# Altium project LVPowerModule.PrjPcb
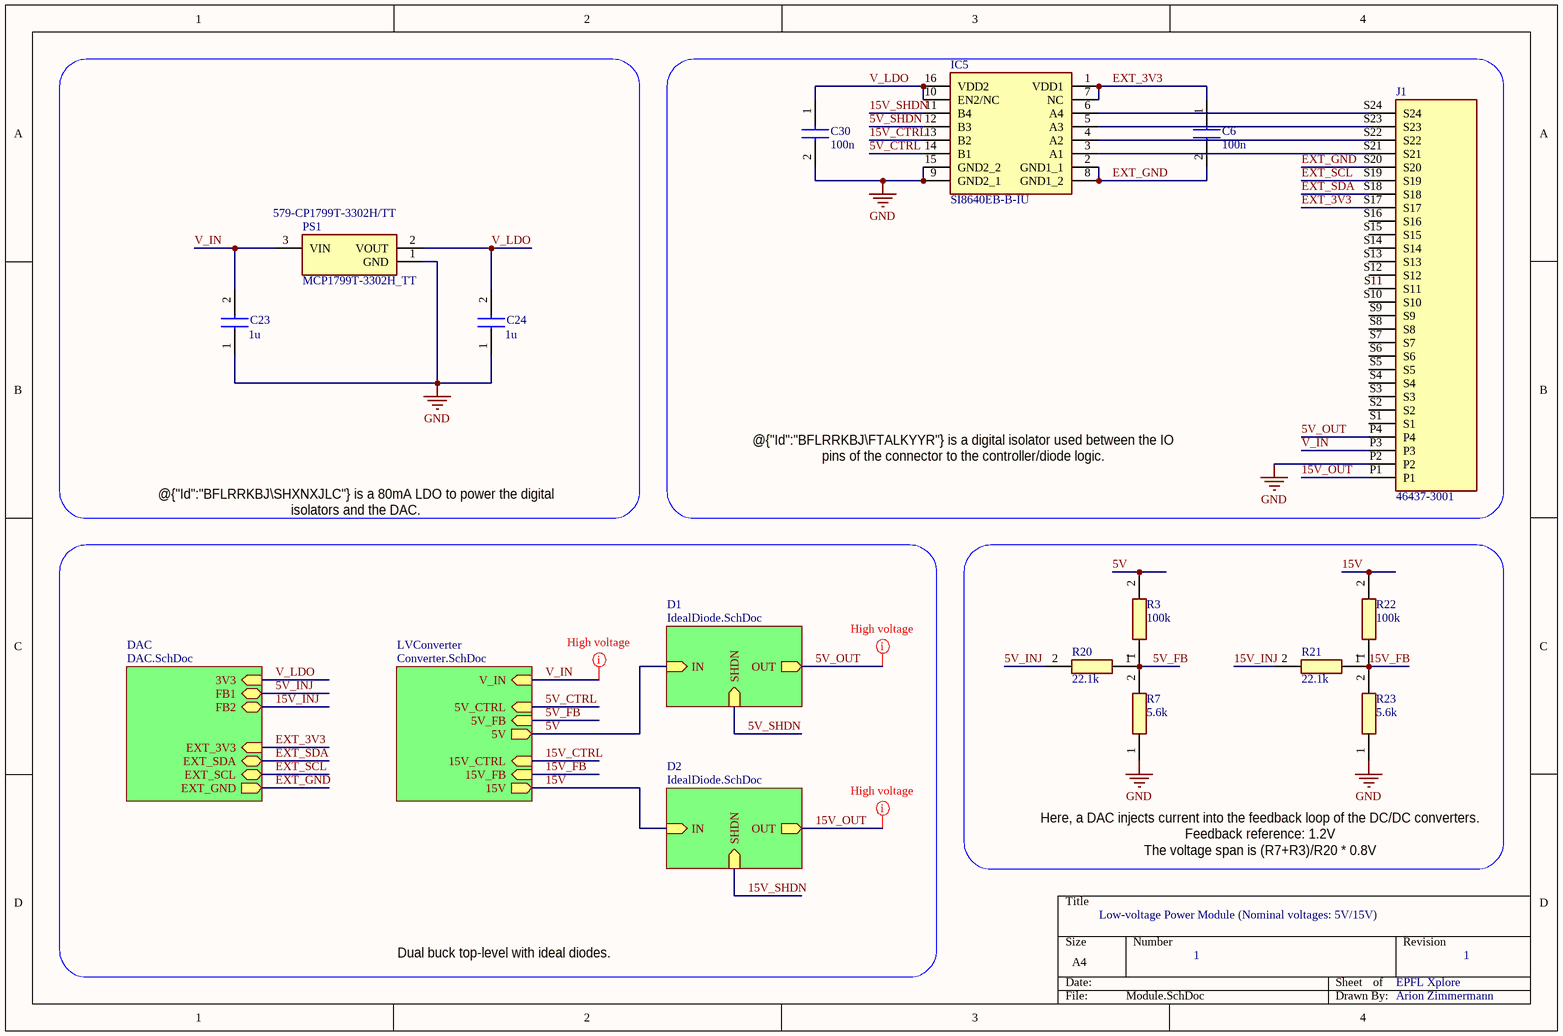
[diagram p0: Module.SchDoc]
4 sheets, 81 parts. Net scope: hierarchical (ports join the sheet entries above them; power ports are global).
Board file: LVPowerModule.PcbDoc
Sheets:
  Module.SchDoc
    LVConverter = Converter.SchDoc
    DAC = DAC.SchDoc
    D2 = IdealDiode.SchDoc
    D1 = IdealDiode.SchDoc

## Sheet Module.SchDoc
size A4; SheetNumber: 1; SheetTotal: 4

### Parts
C6  value 100n  [CAPC1608X95N]  (hidden comment: C0603C104K5RACTU)
C23  value 1u  [CAPC3216X110N]  (hidden comment: C1206C105K5RAC)
C24  value 1u  [CAPC3216X110N]  (hidden comment: C1206C105K5RAC)
C30  value 100n  [CAPC1608X95N]  (hidden comment: C0603C104K5RACTU)
IC5  SI8640EB-B-IU  [SOP64P600X175-16N]
J1  46437-3001  [464373001]
PS1  MCP1799T-3302H_TT  Supplier Part Number 1: 579-CP1799T-3302H/TT  [SOT95P237X112-3N]
R3  value 100k  [RESC1608X55N]  (hidden comment: CRCW0603100KJNEAC)
R7  value 5.6k  [RESC1608X50N]  (hidden comment: CRCW06035K60JNEAC)
R20  value 22.1k  [RESC1608X50N]  (hidden comment: CRCW060322K1FKEB)
R21  value 22.1k  [RESC1608X50N]  (hidden comment: CRCW060322K1FKEB)
R22  value 100k  [RESC1608X55N]  (hidden comment: CRCW0603100KJNEAC)
R23  value 5.6k  [RESC1608X50N]  (hidden comment: CRCW06035K60JNEAC)

### Sub-sheets
D1 = IdealDiode.SchDoc: IN (in), OUT (out), SHDN (in)
D2 = IdealDiode.SchDoc: IN (in), OUT (out), SHDN (in)
DAC = DAC.SchDoc: 3V3 (in), FB2 (bidir), FB1 (bidir), EXT_3V3 (in), EXT_SDA (bidir), EXT_SCL (bidir), EXT_GND (out)
LVConverter = Converter.SchDoc: V_IN (in), 5V (out), 15V (out), 5V_CTRL (in), 15V_CTRL (in), 5V_FB (in), 15V_FB (in)

### Nets
GND: C23.1 C24.1 C30.2 IC5.9(GND2_1) IC5.15(GND2_2) J1.P2 PS1.1(GND) R7.1 R23.1
5V: R3.2 ; sheet LVConverter/5V, sheet D1/IN
5V_CTRL: IC5.14(B1) ; sheet LVConverter/5V_CTRL
5V_FB: R3.1 R7.2 R20.1 ; sheet LVConverter/5V_FB
5V_INJ: R20.2 ; sheet DAC/FB1
5V_OUT: J1.P4 ; sheet D1/OUT
5V_SHDN: IC5.12(B3) ; sheet D1/SHDN
15V: R22.2 ; sheet LVConverter/15V, sheet D2/IN
15V_CTRL: IC5.13(B2) ; sheet LVConverter/15V_CTRL
15V_FB: R21.1 R22.1 R23.2 ; sheet LVConverter/15V_FB
15V_INJ: R21.2 ; sheet DAC/FB2
15V_OUT: J1.P1 ; sheet D2/OUT
15V_SHDN: IC5.11(B4) ; sheet D2/SHDN
EXT_3V3: C6.1 IC5.1(VDD1) IC5.7(NC) J1.S17 ; sheet DAC/EXT_3V3
EXT_GND: C6.2 IC5.2(GND1_1) IC5.8(GND1_2) J1.S20 ; sheet DAC/EXT_GND
EXT_SCL: J1.S19 ; sheet DAC/EXT_SCL
EXT_SDA: J1.S18 ; sheet DAC/EXT_SDA
V_IN: C23.2 J1.P3 PS1.3(VIN) ; sheet LVConverter/V_IN
V_LDO: C24.2 C30.1 IC5.10(EN2/NC) IC5.16(VDD2) PS1.2(VOUT) ; sheet DAC/3V3
NetIC5_3: IC5.3(A1) J1.S21
NetIC5_4: IC5.4(A2) J1.S22
NetIC5_5: IC5.5(A3) J1.S23
NetIC5_6: IC5.6(A4) J1.S24

Not connected (* = marked no-connect by the designer): J1 S1 S2 S3 S4 S5 S6 S7 S8 S9 S10 S11 S12 S13 S14 S15 S16

### Layout directives
net class HV4: 15V_OUT
net class HV2: 5V_OUT
net class HV: V_IN

### Notes on the sheet
- @{"Id":"BFLRRKBJ\SHXNXJLC"} is a 80mA LDO to power the digital isolators and the DAC.
- @{"Id":"BFLRRKBJ\FTALKYYR"} is a digital isolator used between the IO pins of the connector to the controller/diode logic.
- Here, a DAC injects current into the feedback loop of the DC/DC converters.
  Feedback reference: 1.2V
  The voltage span is (R7+R3)/R20 * 0.8V
- Low-voltage Power Module (Nominal voltages: 5V/15V)
- Dual buck top-level with ideal diodes.
- 1
- EPFL Xplore
- Arion Zimmermann

### Library data of the parts
C6 C30 = C0603C104K5RACTU: Capacitor; Manufacturer_Name: Kemet; Datasheet Link: http://www.farnell.com/datasheets/2205446.pdf; Height: 0.95mm; Manufacturer_Part_Number: C0603C104K5RACTU; Mouser Part Number: 80-C0603C104K5R; Mouser Price/Stock: https://www.mouser.co.uk/ProductDetail/KEMET/C0603C104K5RACTU?qs=l5k%252BbMnNDkkVcnZPSAaaiQ%3D%3D; Arrow Part Number: C0603C104K5RACTU; Arrow Price/Stock: https://www.arrow.com/en/products/c0603c104k5ractu/kemet-corporation; Supplier 1: Mouser; Supplier Part Number 1: 80-C0603C104K5R
C23 C24 = C1206C105K5RAC: Capacitor; Manufacturer_Name: KEMET; Datasheet Link: https://www.kemet.com/specsheet/C1206C105K5RACTU; Height: 1.1mm; Manufacturer_Part_Number: C1206C105K5RAC; Mouser Part Number: 80-C1206C105K5RAC; Mouser Price/Stock: https://www.mouser.co.uk/ProductDetail/KEMET/C1206C105K5RAC?qs=NTAB53G5bVDYFBtoIe7UwQ%3D%3D; Arrow Part Number: C1206C105K5RAC; Arrow Price/Stock: https://www.arrow.com/en/products/c1206c105k5rac/kemet-corporation
IC5 = SI8640EB-B-IU: Integrated Circuit; Manufacturer_Name: Skyworks; Datasheet Link: https://www.mouser.in/datasheet/2/472/si864x_datasheet-2507790.pdf; Height: 1.75mm; Manufacturer_Part_Number: SI8640EB-B-IU; Mouser Part Number: 634-SI8640EB-B-IU; Mouser Price/Stock: https://www.mouser.co.uk/ProductDetail/Skyworks-Solutions-Inc/SI8640EB-B-IU?qs=1mbolxNpo8djAX8%252BwHCeQQ%3D%3D
J1 = 46437-3001: Connector; Manufacturer_Name: Molex; Datasheet Link: https://componentsearchengine.com/Datasheets/1/46437-3007.pdf; Height: 10mm; Manufacturer_Part_Number: 46437-3001; Mouser Part Number: 538-46437-3001; Mouser Price/Stock: https://www.mouser.com/Search/Refine.aspx?Keyword=538-46437-3007; System: Connector
PS1 = MCP1799T-3302H_TT: Power Supply; Manufacturer_Name: Microchip; Manufacturer_Part_Number: MCP1799T-3302H/TT; Datasheet Link: https://ms.componentsearchengine.com/Datasheets/1/MCP1799T-3302H_TT.pdf; Height: 1.12mm; Mouser Part Number: 579-CP1799T-3302H/TT; Mouser Price/Stock: https://www.mouser.co.uk/ProductDetail/Microchip-Technology-Atmel/MCP1799T-3302H-TT?qs=BJlw7L4Cy78EAGTR6Iuibw%3D%3D; Arrow Part Number: MCP1799T-3302H/TT; Arrow Price/Stock: https://www.arrow.com/en/products/mcp1799t-3302htt/microchip-technology?region=nac; Supplier 1: Mouser
R3 R22 = CRCW0603100KFKEAC: Resistor; Manufacturer_Name: Vishay; Datasheet Link: https://www.mouser.com/datasheet/2/427/crcwce3-1223726.pdf; Height: 0.55mm; Manufacturer_Part_Number: CRCW0603100KFKEAC; Mouser Part Number: 71-CRCW0603100KFKEAC; Mouser Price/Stock: https://www.mouser.co.uk/ProductDetail/Vishay-Dale/CRCW0603100KFKEAC?qs=E3Y5ESvWgWPxzfNYyMgX1w%3D%3D; Arrow Part Number: CRCW0603100KFKEAC; Arrow Price/Stock: https://www.arrow.com/en/products/crcw0603100kfkeac/vishay; Supplier 1: Mouser; Supplier Part Number 1: 71-CRCW0603100KJNEAC
R7 R23 = CRCW06035K62FKEB: Resistor; Manufacturer_Name: Vishay; Datasheet Link: http://www.vishay.com/docs/20035/dcrcwe3.pdf; Height: 0.5mm; Manufacturer_Part_Number: CRCW06035K62FKEB; Mouser Part Number: 71-CRCW06035K62FKEB; Mouser Price/Stock: https://www.mouser.co.uk/ProductDetail/Vishay-Dale/CRCW06035K62FKEB?qs=P6ImCWcZKGBvDktlVJxa7w%3D%3D; Supplier 1: Mouser; Supplier Part Number 1: 71-CRCW06035K60JNEAC
R20 R21 = CRCW06037K50FKEB: Resistor; Manufacturer_Name: Vishay; Datasheet Link: http://www.vishay.com/docs/20035/dcrcwe3.pdf; Height: 0.5mm; Manufacturer_Part_Number: CRCW06037K50FKEB; Mouser Part Number: 71-CRCW06037K50FKEB; Mouser Price/Stock: https://www.mouser.co.uk/ProductDetail/Vishay-Dale/CRCW06037K50FKEB?qs=2ihuRUavkaTvW2vO4EimMQ%3D%3D; Supplier 1: Mouser; Supplier Part Number 1: 71-CRCW060322K1FKEB

## Sheet Converter.SchDoc
size A4; SheetNumber: 2; SheetTotal: 4
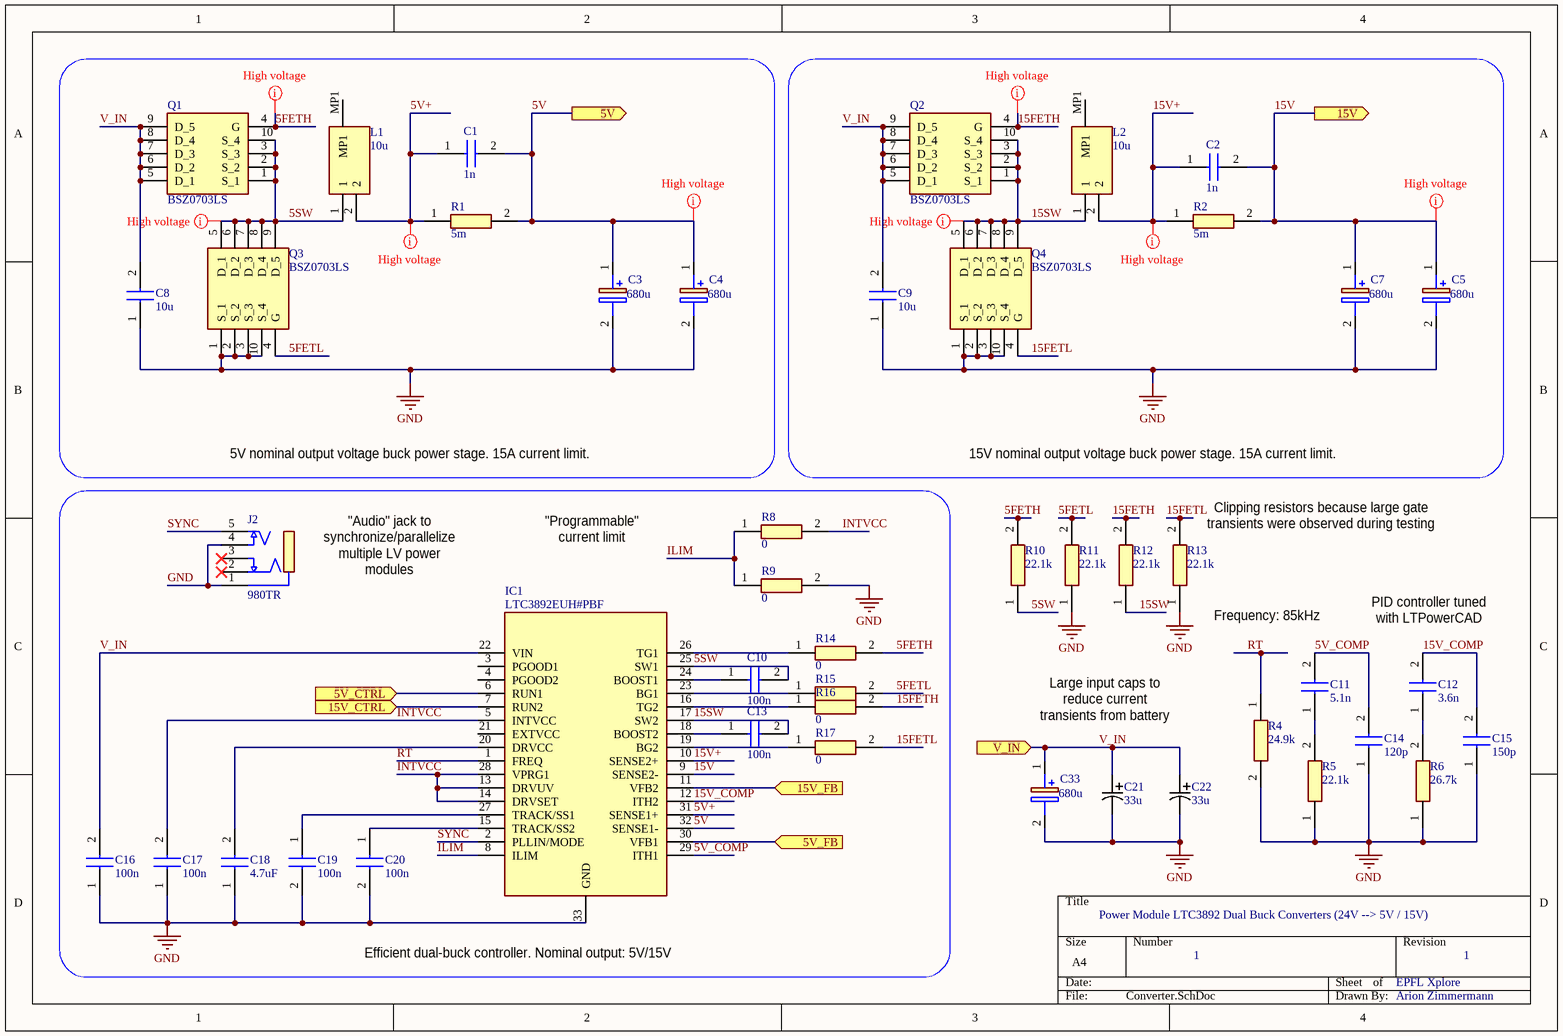
[diagram p1: Converter.SchDoc]

### Parts
C1  value 1n  [CAPC1608X95N]  (hidden comment: C0603C102J5RACTU)
C2  value 1n  [CAPC1608X95N]  (hidden comment: C0603C102J5RACTU)
C3  value 680u  [CAPPRD500W65D1000H1800]  (hidden comment: A750MW687M1VAAE018)
C4  value 680u  [CAPPRD500W65D1000H1800]  (hidden comment: A750MW687M1VAAE018)
C5  value 680u  [CAPPRD500W65D1000H1800]  (hidden comment: A750MW687M1VAAE018)
C7  value 680u  [CAPPRD500W65D1000H1800]  (hidden comment: A750MW687M1VAAE018)
C8  value 10u  [CAPC5750X310N]  (hidden comment: C5750X7S2A106K230KB)
C9  value 10u  [CAPC5750X310N]  (hidden comment: C5750X7S2A106K230KB)
C10  value 100n  [CAPC1608X95N]  (hidden comment: C0603C104K5RACTU)
C11  value 5.1n  [CAPC1608X87N]  (hidden comment: C0603C512J5GACAUTO)
C12  value 3.6n  [CAPC1608X87N]  (hidden comment: C0603C362J5GACTU)
C13  value 100n  [CAPC1608X95N]  (hidden comment: C0603C104K5RACTU)
C14  value 120p  [CAPC1608X87N]  (hidden comment: C0603C121J5GACTU)
C15  value 150p  [CAPC1608X87N]  (hidden comment: C0603C151J5GAC)
C16  value 100n  [CAPC1608X95N]  (hidden comment: C0603C104K5RACTU)
C17  value 100n  [CAPC1608X95N]  (hidden comment: C0603C104K5RACTU)
C18  value 4.7uF  [CAPC3316X195N]  (hidden comment: C1206X475M5RACAUTO)
C19  value 100n  [CAPC1608X95N]  (hidden comment: C0603C104K5RACTU)
C20  value 100n  [CAPC1608X95N]  (hidden comment: C0603C104K5RACTU)
C21  value 33u  [CAPMP7.6X4.3_3.1N_KEM]  (hidden comment: T598D336M035ATE065)
C22  value 33u  [CAPMP7.6X4.3_3.1N_KEM]  (hidden comment: T598D336M035ATE065)
C33  value 680u  [CAPPRD500W65D1000H1800]  (hidden comment: A750MW687M1VAAE018)
IC1  LTC3892EUH#PBF  [QFN50P500X500X80-33N-D]
J2  980TR  [980TR]
L1  value 10u  [PQ2614BLA1R0K]  (hidden comment: PQ2614BHA-100K)
L2  value 10u  [PQ2614BLA1R0K]  (hidden comment: PQ2614BHA-100K)
Q1  BSZ0703LS  [BSZ011NE2LS5IATMA1]
Q2  BSZ0703LS  [BSZ011NE2LS5IATMA1]
Q3  BSZ0703LS  [BSZ011NE2LS5IATMA1]
Q4  BSZ0703LS  [BSZ011NE2LS5IATMA1]
R1  value 5m  [RESC6432X80N]  (hidden comment: CRF2512-FZ-R005ELF)
R2  value 5m  [RESC6432X80N]  (hidden comment: CRF2512-FZ-R005ELF)
R4  value 24.9k  [RESC1608X50N]  (hidden comment: CRCW060324K9FKTA)
R5  value 22.1k  [RESC1608X50N]  (hidden comment: CRCW060322K1FKEB)
R6  value 26.7k  [RESC1608X50N]  (hidden comment: CRCW060326K7FKEB)
R8  Parameter 1: 0  [RESC1608X50N]  (hidden comment: CRCW06030000ZSTB)
R9  Parameter 1: 0  [RESC1608X50N]  (hidden comment: CRCW06030000ZSTB)
R10  value 22.1k  [RESC1608X50N]  (hidden comment: CRCW060322K1FKEB)
R11  value 22.1k  [RESC1608X50N]  (hidden comment: CRCW060322K1FKEB)
R12  value 22.1k  [RESC1608X50N]  (hidden comment: CRCW060322K1FKEB)
R13  value 22.1k  [RESC1608X50N]  (hidden comment: CRCW060322K1FKEB)
R14  Parameter 1: 0  [RESC1608X50N]  (hidden comment: CRCW06030000ZSTB)
R15  Parameter 1: 0  [RESC1608X50N]  (hidden comment: CRCW06030000ZSTB)
R16  Parameter 1: 0  [RESC1608X50N]  (hidden comment: CRCW06030000ZSTB)
R17  Parameter 1: 0  [RESC1608X50N]  (hidden comment: CRCW06030000ZSTB)

### Ports
5V (out), 5V_CTRL (in), 5V_FB (in), 15V (out), 15V_CTRL (in), 15V_FB (in), V_IN (in)

### Nets
GND: C3.2(-) C4.2(-) C5.2(-) C7.2(-) C8.1 C9.1 C14.1 C15.1 C16.1 C17.1 C18.1 C19.2 C20.2 C21.2 C22.2 C33.2(-) IC1.33(GND) J2.1 J2.4 Q3.1(S_1) Q3.2(S_2) Q3.3(S_3) Q3.10(S_4) Q4.1(S_1) Q4.2(S_2) Q4.3(S_3) Q4.10(S_4) R4.2 R5.1 R6.1 R9.2 R11.1 R13.1
5FETH: Q1.4(G) R10.2 R14.2
5FETL: Q3.4(G) R11.2 R15.2
5SW: C10.2 IC1.25(SW1) L1.1 Q1.1(S_1) Q1.2(S_2) Q1.3(S_3) Q1.10(S_4) Q3.5(D_1) Q3.6(D_2) Q3.7(D_3) Q3.8(D_4) Q3.9(D_5) R10.1
5V: C1.2 C3.1(+) C4.1(+) IC1.32(SENSE1-) R1.2 ; port 5V
5V+: C1.1 IC1.31(SENSE1+) L1.2 R1.1
5V_COMP: C11.2 C14.2 IC1.29(ITH1)
5V_CTRL: IC1.6(RUN1) ; port 5V_CTRL
5V_FB: IC1.30(VFB1) ; port 5V_FB
15FETH: Q2.4(G) R12.2 R16.2
15FETL: Q4.4(G) R13.2 R17.2
15SW: C13.2 IC1.17(SW2) L2.1 Q2.1(S_1) Q2.2(S_2) Q2.3(S_3) Q2.10(S_4) Q4.5(D_1) Q4.6(D_2) Q4.7(D_3) Q4.8(D_4) Q4.9(D_5) R12.1
15V: C2.2 C5.1(+) C7.1(+) IC1.9(SENSE2-) R2.2 ; port 15V
15V+: C2.1 IC1.10(SENSE2+) L2.2 R2.1
15V_COMP: C12.2 C15.2 IC1.12(ITH2)
15V_CTRL: IC1.7(RUN2) ; port 15V_CTRL
15V_FB: IC1.11(VFB2) ; port 15V_FB
ILIM: IC1.8(ILIM) R8.1 R9.1
INTVCC: C17.2 IC1.5(INTVCC) IC1.13(DRVUV) IC1.14(DRVSET) IC1.28(VPRG1) R8.2
RT: IC1.1(FREQ) R4.1
SYNC: IC1.2(PLLIN/MODE) J2.5
V_IN: C8.2 C9.2 C16.2 C21.1 C22.1 C33.1(+) IC1.22(VIN) Q1.5(D_1) Q1.6(D_2) Q1.7(D_3) Q1.8(D_4) Q1.9(D_5) Q2.5(D_1) Q2.6(D_2) Q2.7(D_3) Q2.8(D_4) Q2.9(D_5) ; port V_IN
NetC10_1: C10.1 IC1.24(BOOST1)
NetC11_1: C11.1 R5.2
NetC12_1: C12.1 R6.2
NetC13_1: C13.1 IC1.18(BOOST2)
NetC18_2: C18.2 IC1.20(DRVCC)
NetC19_1: C19.1 IC1.27(TRACK/SS1)
NetC20_1: C20.1 IC1.15(TRACK/SS2)
NetIC1_16: IC1.16(TG2) R16.1
NetIC1_19: IC1.19(BG2) R17.1
NetIC1_23: IC1.23(BG1) R15.1
NetIC1_26: IC1.26(TG1) R14.1

Not connected (* = marked no-connect by the designer): IC1 3(PGOOD1) 4(PGOOD2) 21(EXTVCC); J2 2* 3*; L1 MP1; L2 MP1

### Layout directives
net class HV2: 15V
net class HV1: 15V+
net class HV: 5FETH, 5SW, 15FETH, 15SW
net class HV3: 5V+
net class HV4: 5V

### Notes on the sheet
- 5V nominal output voltage buck power stage. 15A current limit.
- 15V nominal output voltage buck power stage. 15A current limit.
- (near R13) Clipping resistors because large gate transients were observed during testing
- "Audio" jack to synchronize/parallelize multiple LV power modules
- (near IC1) "Programmable" current limit
- (near R13) Frequency: 85kHz
- PID controller tuned with LTPowerCAD
- Large input caps to reduce current transients from battery
- Power Module LTC3892 Dual Buck Converters (24V --> 5V / 15V)
- (near IC1) Efficient dual-buck controller. Nominal output: 5V/15V
- 1
- EPFL Xplore
- Arion Zimmermann

### Library data of the parts
C1 C2 C10 C13 C16 C17 C19 C20 = C0603C104K5RACTU: Capacitor; Manufacturer_Name: Kemet; Datasheet Link: http://www.farnell.com/datasheets/2205446.pdf; Height: 0.95mm; Manufacturer_Part_Number: C0603C104K5RACTU; Mouser Part Number: 80-C0603C104K5R; Mouser Price/Stock: https://www.mouser.co.uk/ProductDetail/KEMET/C0603C104K5RACTU?qs=l5k%252BbMnNDkkVcnZPSAaaiQ%3D%3D; Arrow Part Number: C0603C104K5RACTU; Arrow Price/Stock: https://www.arrow.com/en/products/c0603c104k5ractu/kemet-corporation; Supplier 1: Mouser
  C1 C2: Supplier Part Number 1: 80-C0603C102J5R
  C10 C13 C16 C17 C19 C20: Supplier Part Number 1: 80-C0603C104K5R
C3-C5 C7 C33 = A750MW687M1VAAE018: Capacitor Polarised; Manufacturer_Name: Kemet; Datasheet Link: https://www.kemet.com/specsheet/A750MW687M1VAAE018; Height: 18mm; Manufacturer_Part_Number: A750MW687M1VAAE018
C8 C9 = C5750X7S2A106K230KB: Capacitor; Manufacturer_Name: TDK; Datasheet Link: http://www.mouser.com/ds/2/400/lcc_commercial_general_en-837201.pdf; Height: 3.1mm; Manufacturer_Part_Number: C5750X7S2A106K230KB; Arrow Part Number: C5750X7S2A106K230KB; Arrow Price/Stock: https://www.arrow.com/en/products/c5750x7s2a106k230kb/tdk; Mouser Part Number: 810-C5750X7S2A106KKB; Mouser Price/Stock: https://www.mouser.co.uk/ProductDetail/TDK/C5750X7S2A106K230KB?qs=XHchNesRtUZKzUEzha8N7w%3D%3D; Supplier 1: Mouser; Supplier Part Number 1: 810-C5750X7S2A106KKB
C11 = C0603C222J5RACAUTO: Capacitor; Manufacturer_Name: Kemet; Datasheet Link: https://api.kemet.com/component-edge/download/datasheet/C0603C222J5RACAUTO.pdf; Height: 0.87mm; Manufacturer_Part_Number: C0603C222J5RACAUTO; Mouser Part Number: 80-C0603C222J5RAUTO; Mouser Price/Stock: https://www.mouser.co.uk/ProductDetail/KEMET/C0603C222J5RACAUTO?qs=XYJIsZbdjSPu3wyG4zpZ%252Bg%3D%3D; Arrow Part Number: C0603C222J5RACAUTO; Arrow Price/Stock: https://www.arrow.com/en/products/c0603c222j5racauto/kemet-corporation; Supplier 1: Mouser; Supplier Part Number 1: 80-C0603C512J5GAUTO
C12 = C0603C102J5RACTU: Capacitor; Manufacturer_Name: Kemet; Datasheet Link: https://api.kemet.com/component-edge/download/datasheet/C0603C102J5RACTU.pdf; Height: 0.87mm; Manufacturer_Part_Number: C0603C102J5RACTU; Mouser Part Number: 80-C0603C102J5R; Mouser Price/Stock: https://www.mouser.co.uk/ProductDetail/KEMET/C0603C102J5RACTU?qs=qG1y%252BaZBm0ORyW8zMfKotw%3D%3D; Arrow Part Number: C0603C102J5RACTU; Arrow Price/Stock: https://www.arrow.com/en/products/c0603c102j5ractu/kemet-corporation; Supplier 1: Mouser; Supplier Part Number 1: 80-C0603C362J5G
C14 C15 = C0603C101J5RACTU: Capacitor; Manufacturer_Name: Kemet; Datasheet Link: https://componentsearchengine.com/Datasheets/1/C0603C101J5RACTU.pdf; Height: 0.87mm; Manufacturer_Part_Number: C0603C101J5RACTU; Mouser Part Number: 80-C0603C101J5R; Mouser Price/Stock: https://www.mouser.com/Search/Refine.aspx?Keyword=80-C0603C101J5R; Arrow Part Number: C0603C101J5RACTU; Arrow Price/Stock: https://www.arrow.com/en/products/c0603c101j5ractu/kemet-corporation; Supplier 1: Mouser
  C14: Supplier Part Number 1: 80-C0603C121J5G
  C15: Supplier Part Number 1: 80-C0603C151J5G
C18 = C1206X475M5RACAUTO: Capacitor; Manufacturer_Name: Kemet; Datasheet Link: https://www.kemet.com/specsheet/C1206X475M5RACAUTO; Height: 1.95mm; Manufacturer_Part_Number: C1206X475M5RACAUTO; Mouser Part Number: 80-C1206X475M5RAUTO; Mouser Price/Stock: https://www.mouser.co.uk/ProductDetail/KEMET/C1206X475M5RACAUTO?qs=%252B6g0mu59x7LXtOZABrHA3A%3D%3D; Supplier 1: Mouser; Supplier Part Number 1: 80-C1206X475M5RAUTO
C21 C22 = T598D336M035ATE065: No Description Available; Vendor: Kemet; SourceLibrary: Kemet_2020-03-25_3; Built_By: EMA_Frank; Source_Library: Kemet_2020-03-25_3.xlr; Type: DEV; Manufacturer_Part_Number: T598D336M035ATE065; Copyright: Copyright (C) 2018 Accelerated Designs. All rights reserved; RefDes: RefDes; Supplier 1: Mouser; Supplier Part Number 1: 80-T598D336M35E65
IC1 = LTC3892EUH#PBF: Integrated Circuit; Manufacturer_Name: Analog Devices; Datasheet Link: https://static6.arrow.com/aropdfconversion/d55dab638e5428544f7d993794f5b08548362f1a/25521248972647946369.pdf; Height: 0.8mm; Manufacturer_Part_Number: LTC3892EUH#PBF; Arrow Part Number: LTC3892EUH#PBF; Arrow Price/Stock: https://www.arrow.com/en/products/ltc3892euhpbf/analog-devices; Supplier 1: Mouser; Supplier Part Number 1: 584-LTC3892EUH-2#PBF
J2 = 980TR: Connector; Manufacturer_Name: Keystone Electronics; Datasheet Link: https://www.keyelco.com/product.cfm/product_id/2402; Height: 4.14mm; Manufacturer_Part_Number: 980TR; Mouser Part Number: 534-980; Mouser Price/Stock: https://www.mouser.co.uk/ProductDetail/Keystone-Electronics/980TR?qs=sOYabIlKNmdpbsH5J2zkLQ%3D%3D
L1 L2 = PQ2614BHA-100K: Inductor; Manufacturer_Name: Bourns; Datasheet Link: https://www.bourns.com/docs/Product-Datasheets/PQ2614.pdf; Height: 16mm; Manufacturer_Part_Number: PQ2614BHA-100K; Mouser Part Number: 652-PQ2614BHA-100K; Mouser Price/Stock: https://www.mouser.co.uk/ProductDetail/Bourns/PQ2614BHA-100K?qs=1mbolxNpo8cus7p6tzCJzA%3D%3D; Arrow Part Number: PQ2614BHA-100K; Arrow Price/Stock: https://www.arrow.com/en/products/pq2614bha-100k/bourns?region=nac; Supplier 1: Mouser; Supplier Part Number 1: 652-PQ2614BHA-100K
Q1-Q4 = BSZ011NE2LS5IATMA1: MOSFET (N-Channel); Manufacturer_Name: Infineon; Datasheet Link: https://componentsearchengine.com/Datasheets/1/BSZ011NE2LS5IATMA1.pdf; Height: 1.1mm; Manufacturer_Part_Number: BSZ011NE2LS5IATMA1; Mouser Part Number: 726-BSZ011NE2LS5IATM; Mouser Price/Stock: https://www.mouser.co.uk/ProductDetail/Infineon-Technologies/BSZ011NE2LS5IATMA1?qs=PzGy0jfpSMvXxmHh4MC9dw%3D%3D; Supplier 1: Mouser; Supplier Part Number 1: 726-BSZ0703LSATMA1
R1 R2 = CRF2512-FZ-R005ELF: Resistor; Manufacturer_Name: Bourns; Datasheet Link: https://www.arrow.com/en/products/crf2512-fz-r005elf/bourns; Height: 0.8mm; Manufacturer_Part_Number: CRF2512-FZ-R005ELF; Mouser Part Number: 652-CRF2512FZR005ELF; Mouser Price/Stock: https://www.mouser.co.uk/ProductDetail/Bourns/CRF2512-FZ-R005ELF/?qs=iHX4uCgIbgMqZUuYK4Zqgg%3D%3D; Arrow Part Number: CRF2512-FZ-R005ELF; Arrow Price/Stock: https://www.arrow.com/en/products/crf2512-fz-r005elf/bourns; Supplier 1: Mouser; Supplier Part Number 1: 652-CRF2512FZR005ELF
R4 = CRCW060324K9FKEA: Resistor; Manufacturer_Name: Vishay; Datasheet Link: http://www.vishay.com/docs/20035/dcrcwe3.pdf; Height: 0.5mm; Manufacturer_Part_Number: CRCW060324K9FKEA; Mouser Part Number: 71-CRCW0603-24.9K-E3; Mouser Price/Stock: https://www.mouser.co.uk/ProductDetail/Vishay-Dale/CRCW060324K9FKEA?qs=duauLwvczSYlbxc75y0kVA%3D%3D; Arrow Part Number: CRCW060324K9FKEA; Arrow Price/Stock: https://www.arrow.com/en/products/crcw060324k9fkea/vishay; Supplier 1: Mouser; Supplier Part Number 1: 71-CRCW0603-24.9K
R5 R10-R13 = CRCW06037K50FKEB: Resistor; Manufacturer_Name: Vishay; Datasheet Link: http://www.vishay.com/docs/20035/dcrcwe3.pdf; Height: 0.5mm; Manufacturer_Part_Number: CRCW06037K50FKEB; Mouser Part Number: 71-CRCW06037K50FKEB; Mouser Price/Stock: https://www.mouser.co.uk/ProductDetail/Vishay-Dale/CRCW06037K50FKEB?qs=2ihuRUavkaTvW2vO4EimMQ%3D%3D; Supplier 1: Mouser; Supplier Part Number 1: 71-CRCW060322K1FKEB
R6 = CRCW060334K0FKEA: Resistor; Manufacturer_Name: Vishay; Datasheet Link: http://www.vishay.com/docs/20035/dcrcwe3.pdf; Height: 0.5mm; Manufacturer_Part_Number: CRCW060334K0FKEA; Mouser Part Number: 71-CRCW0603-34K-E3; Mouser Price/Stock: https://www.mouser.com/Search/Refine.aspx?Keyword=71-CRCW0603-34K-E3; Arrow Part Number: CRCW060334K0FKEA; Arrow Price/Stock: https://www.arrow.com/en/products/crcw060334k0fkea/vishay; Supplier 1: Mouser; Supplier Part Number 1: 71-CRCW060326K7FKEB
R8 R9 R14-R17 = CRCW06030000ZSTB: Resistor; Manufacturer_Name: Vishay; Datasheet Link: http://www.vishay.com/docs/20035/dcrcwe3.pdf; Height: 0.5mm; Manufacturer_Part_Number: CRCW06030000ZSTB; Mouser Part Number: 71-CRCW0603000ZT-RT5; Mouser Price/Stock: https://www.mouser.co.uk/ProductDetail/Vishay-Dale/CRCW06030000ZSTB?qs=2ymmDbJkxOjBfbAlbZJVUA%3D%3D; Arrow Part Number: CRCW06030000ZSTB; Arrow Price/Stock: https://www.arrow.com/en/products/crcw06030000zstb/vishay?region=nac; Supplier 1: Mouser; Supplier Part Number 1: 71-CRCW0603000ZT-RT5

## Sheet DAC.SchDoc
size A4; SheetNumber: 3; SheetTotal: 4
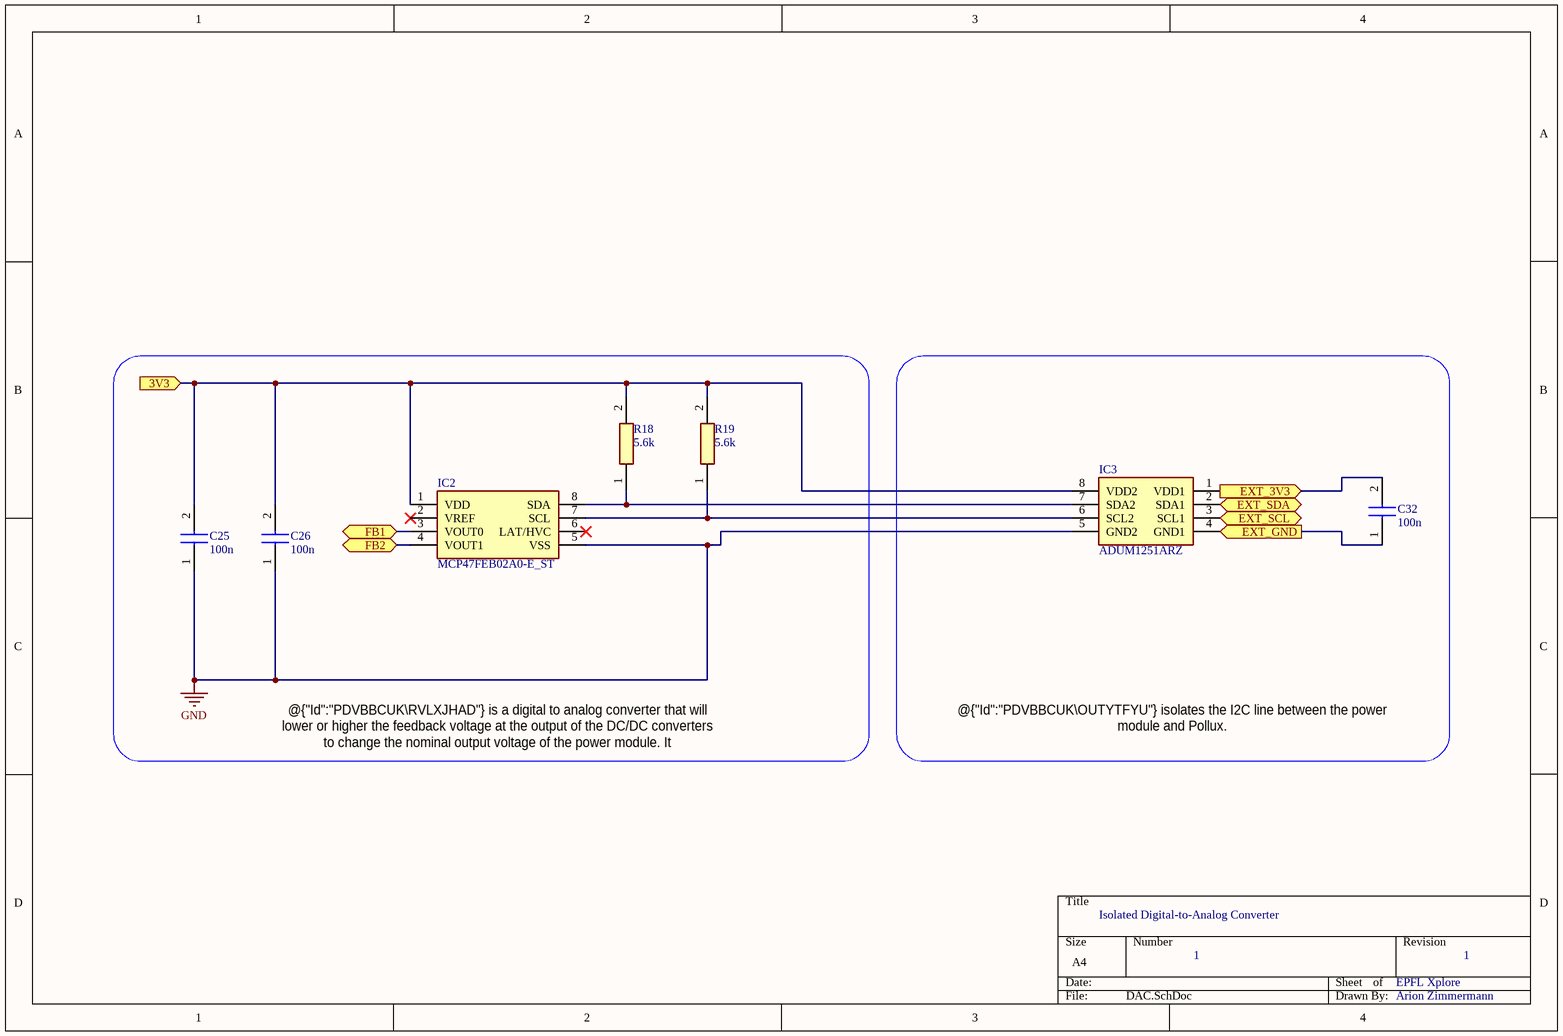
[diagram p2: DAC.SchDoc]

### Parts
C25  value 100n  [CAPC1608X95N]  (hidden comment: C0603C104K5RACTU)
C26  value 100n  [CAPC1608X95N]  (hidden comment: C0603C104K5RACTU)
C32  value 100n  [CAPC1608X95N]  (hidden comment: C0603C104K5RACTU)
IC2  MCP47FEB02A0-E_ST  [SOP65P640X120-8N]
IC3  ADUM1251ARZ  [SOIC127P600X175-8N]
R18  value 5.6k  [RESC1608X50N]  (hidden comment: CRCW06035K60JNEAC)
R19  value 5.6k  [RESC1608X50N]  (hidden comment: CRCW06035K60JNEAC)

### Ports
3V3 (in), EXT_3V3 (in), EXT_GND (out), EXT_SCL (bidir), EXT_SDA (bidir), FB1 (bidir), FB2 (bidir)

### Nets
GND: C25.1 C26.1 IC2.5(VSS) IC3.5(GND2)
5V_INJ: IC2.3(VOUT0) ; port FB1
15V_INJ: IC2.4(VOUT1) ; port FB2
EXT_3V3: C32.2 IC3.1(VDD1) ; port EXT_3V3
EXT_GND: C32.1 IC3.4(GND1) ; port EXT_GND
EXT_SCL: IC3.3(SCL1) ; port EXT_SCL
EXT_SDA: IC3.2(SDA1) ; port EXT_SDA
V_LDO: C25.2 C26.2 IC2.1(VDD) IC3.8(VDD2) R18.2 R19.2 ; port 3V3
NetIC2_7: IC2.7(SCL) IC3.6(SCL2) R19.1
NetIC2_8: IC2.8(SDA) IC3.7(SDA2) R18.1

Not connected (* = marked no-connect by the designer): IC2 2(VREF)* 6(LAT/HVC)*

### Notes on the sheet
- @{"Id":"PDVBBCUK\RVLXJHAD"} is a digital to analog converter that will lower or higher the feedback voltage at the output of the DC/DC converters to change the nominal output voltage of the power module. It communicates with I2C to Pollux.
- @{"Id":"PDVBBCUK\OUTYTFYU"} isolates the I2C line between the power module and Pollux.
- Isolated Digital-to-Analog Converter
- 1
- EPFL Xplore
- Arion Zimmermann

### Library data of the parts
C25 C26 C32 = C0603C104K5RACTU: Capacitor; Manufacturer_Name: Kemet; Datasheet Link: http://www.farnell.com/datasheets/2205446.pdf; Height: 0.95mm; Manufacturer_Part_Number: C0603C104K5RACTU; Mouser Part Number: 80-C0603C104K5R; Mouser Price/Stock: https://www.mouser.co.uk/ProductDetail/KEMET/C0603C104K5RACTU?qs=l5k%252BbMnNDkkVcnZPSAaaiQ%3D%3D; Arrow Part Number: C0603C104K5RACTU; Arrow Price/Stock: https://www.arrow.com/en/products/c0603c104k5ractu/kemet-corporation; Supplier 1: Mouser; Supplier Part Number 1: 80-C0603C104K5R
IC2 = MCP47FEB02A0-E_ST: Integrated Circuit; Manufacturer_Name: Microchip; Manufacturer_Part_Number: MCP47FEB02A0-E/ST; Datasheet Link: http://www.microchip.com/mymicrochip/filehandler.aspx?ddocname=en573220; Height: 1.2mm; Mouser Part Number: 579-MCP47FEB02A0EST; Mouser Price/Stock: https://www.mouser.co.uk/ProductDetail/Microchip-Technology/MCP47FEB02A0-E-ST?qs=rQCxX1QmdjKDJonwz1QvmA%3D%3D; Arrow Part Number: MCP47FEB02A0-E/ST; Arrow Price/Stock: https://www.arrow.com/en/products/mcp47feb02a0-est/microchip-technology?region=nac
IC3 = ADUM1251ARZ: Integrated Circuit; Manufacturer_Name: Analog Devices; Datasheet Link: https://datasheet.datasheetarchive.com/originals/distributors/Datasheets-DGA3/264898.pdf; Height: 1.75mm; Manufacturer_Part_Number: ADUM1251ARZ; Mouser Part Number: 584-ADUM1251ARZ; Mouser Price/Stock: https://www.mouser.co.uk/ProductDetail/Analog-Devices/ADUM1251ARZ?qs=WIvQP4zGani5W7Ldr0QsZA%3D%3D; Arrow Part Number: ADUM1251ARZ; Arrow Price/Stock: https://www.arrow.com/en/products/adum1251arz/analog-devices?region=nac; Supplier 1: Mouser; Supplier Part Number 1: 584-ADUM1251ARZ
R18 R19 = CRCW06035K62FKEB: Resistor; Manufacturer_Name: Vishay; Datasheet Link: http://www.vishay.com/docs/20035/dcrcwe3.pdf; Height: 0.5mm; Manufacturer_Part_Number: CRCW06035K62FKEB; Mouser Part Number: 71-CRCW06035K62FKEB; Mouser Price/Stock: https://www.mouser.co.uk/ProductDetail/Vishay-Dale/CRCW06035K62FKEB?qs=P6ImCWcZKGBvDktlVJxa7w%3D%3D; Supplier 1: Mouser; Supplier Part Number 1: 71-CRCW06035K60JNEAC

## Sheet IdealDiode.SchDoc
size A4; SheetNumber: 4; SheetTotal: 4
Used 2 times, as channels D2, D1. Parts and nets are listed once, with the designators drawn on the sheet.
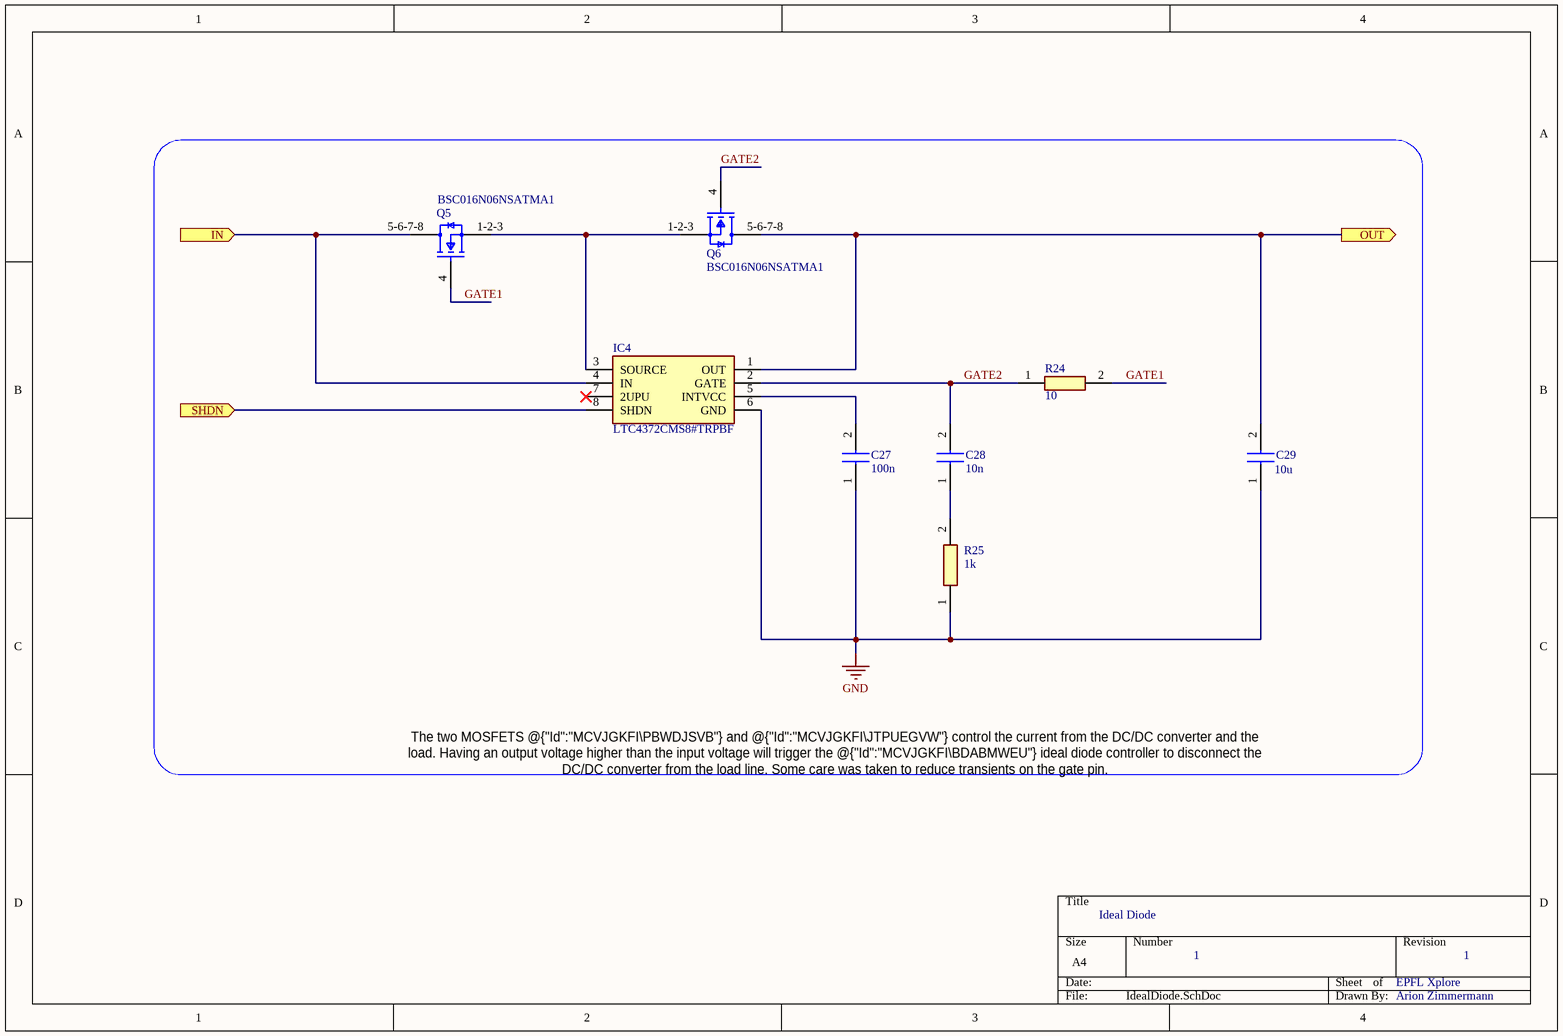
[diagram p3: IdealDiode.SchDoc]

### Parts
C27  value 100n  [CAPC1608X95N]  (hidden comment: C0603C104K5RACTU)
C28  value 10n  [CAPC1608X95N]  (hidden comment: C0603C103K5RACTU)
C29  value 10u  [CAPC3225X230N]  (hidden comment: C3225X7R2A106K250AC)
IC4  LTC4372CMS8#TRPBF  [SOP65P490X110-8N]
Q5  BSC016N06NSATMA1  [FP-PG-TDSON-8-MFG]
Q6  BSC016N06NSATMA1  [FP-PG-TDSON-8-MFG]
R24  value 10  [RESC1608X55N]  (hidden comment: CRCW060310R0JNEAC)
R25  value 1k  [RESC1608X55N]  (hidden comment: CRCW06031K00FKECC)

### Ports
IN (in), OUT (out), SHDN (in)

### Nets
GND: C27.1 C29.1 IC4.6(GND) R25.1
GATE1: Q5.4(G) R24.2
GATE2: C28.2 IC4.2(GATE) Q6.4(G) R24.1
IN: IC4.4(IN) Q5.5-6-7-8(D) ; port IN
OUT: C29.2 IC4.1(OUT) Q6.5-6-7-8(D) ; port OUT
SHDN: IC4.8(SHDN) ; port SHDN
NetC27_2: C27.2 IC4.5(INTVCC)
NetC28_1: C28.1 R25.2
NetIC4_3: IC4.3(SOURCE) Q5.1-2-3(S) Q6.1-2-3(S)

Not connected (* = marked no-connect by the designer): IC4 7(2UPU)*

### Channels
D2: designators end in _D2; ports IN=15V OUT=15V_OUT SHDN=15V_SHDN
D1: designators end in _D1; ports IN=5V OUT=5V_OUT SHDN=5V_SHDN

### Notes on the sheet
- The two MOSFETS @{"Id":"MCVJGKFI\PBWDJSVB"} and @{"Id":"MCVJGKFI\JTPUEGVW"} control the current from the DC/DC converter and the load. Having an output voltage higher than the input voltage will trigger the @{"Id":"MCVJGKFI\BDABMWEU"} ideal diode controller to disconnect the DC/DC converter from the load line. Some care was taken to reduce transients on the gate pin.
- Ideal Diode
- 1
- EPFL Xplore
- Arion Zimmermann

### Library data of the parts
C27 C28 = C0603C104K5RACTU: Capacitor; Manufacturer_Name: Kemet; Datasheet Link: http://www.farnell.com/datasheets/2205446.pdf; Height: 0.95mm; Manufacturer_Part_Number: C0603C104K5RACTU; Mouser Part Number: 80-C0603C104K5R; Mouser Price/Stock: https://www.mouser.co.uk/ProductDetail/KEMET/C0603C104K5RACTU?qs=l5k%252BbMnNDkkVcnZPSAaaiQ%3D%3D; Arrow Part Number: C0603C104K5RACTU; Arrow Price/Stock: https://www.arrow.com/en/products/c0603c104k5ractu/kemet-corporation; Supplier 1: Mouser; Supplier Part Number 1: 80-C0603C104K5R
C29 = C3225X7R2A106K250AC: Capacitor; Manufacturer_Name: TDK; Datasheet Link: https://product.tdk.com/info/en/catalog/datasheets/mlcc_commercial_midvoltage_en.pdf; Height: 2.3mm; Manufacturer_Part_Number: C3225X7R2A106K250AC; Mouser Part Number: 810-C3225X7R2A106K25; Mouser Price/Stock: https://www.mouser.co.uk/ProductDetail/TDK/C3225X7R2A106K250AC?qs=rSMjJ%252B1ewcQNu1nTZev8UA%3D%3D
IC4 = LTC4372CMS8#TRPBF: Integrated Circuit; Manufacturer_Name: Analog Devices; Datasheet Link: https://www.arrow.com/en/products/ltc4372cms8trpbf/analog-devices; Height: 1.1mm; Manufacturer_Part_Number: LTC4372CMS8#TRPBF; Mouser Part Number: 584-LTC4372CMS8TRPBF; Mouser Price/Stock: https://www.mouser.co.uk/ProductDetail/Analog-Devices/LTC4372CMS8TRPBF?qs=T94vaHKWudSmRk6S7wUTVw%3D%3D; Arrow Part Number: LTC4372CMS8#TRPBF; Arrow Price/Stock: https://www.arrow.com/en/products/ltc4372cms8trpbf/analog-devices; Supplier 1: Mouser; Supplier Part Number 1: 584-LTC4372CMS8TRPBF
Q5 Q6 = CMP-32901-000166-1: MOSFET N-CH 60V 30A TDSON-8; Manufacturer: Infineon; Reverse Recovery Charge: 78nC; Power Dissipation: 2.5W; Transconductance: 140S; Gate Charge At Vgs: 71nC @ 10V; Turn On Delay Time: 19ns; Number Of Channels: 1; Typ Forward Diode Voltage: 0.9V; Depletion Mode: False; Max Forward Diode Voltage: 1.2V; Reverse Recovery Time: 61ns; Input Capacitace At Vds: 5200pF @ 30V; Gate To Source Voltage: 20V; Threshold Vgs Min: 2.1V; Drain To Source Resistance: 1.4mΩ; Turn Off Delay Time: 35ns; Threshold Vgs Max: 3.3V; Pulse Drain Current: 400A; Rthja Max: 50K/W; Max Junction Temp: +150°C; Temperature Range High: +150°C; Lead Free: Yes; ComponentLink2URL: https://www.infineon.com/dgdl/Infineon-BSC016N06NS-DS-v02_01-en.pdf?fileId=db3a3043353fdc160135532b353c483c; Device Class L2: Transistors; Drain To Source Voltage: 60V; ComponentLink2Description: Datasheet; Device Class L1: Discrete Semiconductors; Drain To Source Breakdown Voltage: 60V; Manufacturer Part Number: BSC016N06NSATMA1; Continuous Drain Current: 30A; Package: PG-TDSON-8; Octopart: https://octopart.com/bsc016n06nsatma1-infineon-23421881; Automotive: No; Temperature Range Low: -55°C; Footprint Url: https://www.infineon.com/cms/en/product/packages/PG-TDSON/PG-TDSON-8-17/; RoHS: TRUE; Number Of N Channels: 1; Temperature: -55°C to +150°C; Height: 1.1mm; Device Class L3: MOSFETs; Category: Trans; Digikey Description: MOSFET N-CH 60V 30A TDSON-8
R24 R25 = CRCW0603100RFKEBC: Resistor; Manufacturer_Name: Vishay; Datasheet Link: https://www.vishay.com/docs/28773/crcwce3.pdf; Height: 0.55mm; Manufacturer_Part_Number: CRCW0603100RFKEBC; Mouser Part Number: 71-CRCW0603100RFKEBC; Mouser Price/Stock: https://www.mouser.co.uk/ProductDetail/Vishay-Dale/CRCW0603100RFKEBC?qs=wd5RIQLrsJhdvQFtBw4oWg%3D%3D; Arrow Part Number: CRCW0603100RFKEBC; Arrow Price/Stock: https://www.arrow.com/en/products/crcw0603100rfkebc/vishay?region=nac

## Nets that join several sheets
GND: Module (9 pins), Converter (33 pins), DAC (C25.1 C26.1 IC2.5 IC3.5), D2 (C27_D2.1 C29_D2.1 IC4_D2.6 R25_D2.1), D1 (C27_D1.1 C29_D1.1 IC4_D1.6 R25_D1.1)
5V: Module (R3.2), Converter (5 pins), D1 (IC4_D1.4 Q5_D1.5-6-7-8)
5V_CTRL: Module (IC5.14), Converter (IC1.6)
5V_FB: Module (R3.1 R7.2 R20.1), Converter (IC1.30)
5V_INJ: Module (R20.2), DAC (IC2.3)
5V_OUT: Module (J1.P4), D1 (C29_D1.2 IC4_D1.1 Q6_D1.5-6-7-8)
5V_SHDN: Module (IC5.12), D1 (IC4_D1.8)
15V: Module (R22.2), Converter (5 pins), D2 (IC4_D2.4 Q5_D2.5-6-7-8)
15V_CTRL: Module (IC5.13), Converter (IC1.7)
15V_FB: Module (R21.1 R22.1 R23.2), Converter (IC1.11)
15V_INJ: Module (R21.2), DAC (IC2.4)
15V_OUT: Module (J1.P1), D2 (C29_D2.2 IC4_D2.1 Q6_D2.5-6-7-8)
15V_SHDN: Module (IC5.11), D2 (IC4_D2.8)
EXT_3V3: Module (C6.1 IC5.1 IC5.7 J1.S17), DAC (C32.2 IC3.1)
EXT_GND: Module (C6.2 IC5.2 IC5.8 J1.S20), DAC (C32.1 IC3.4)
EXT_SCL: Module (J1.S19), DAC (IC3.3)
EXT_SDA: Module (J1.S18), DAC (IC3.2)
V_IN: Module (C23.2 J1.P3 PS1.3), Converter (17 pins)
V_LDO: Module (5 pins), DAC (6 pins)